# EAGLE schematic RCShield-v4 (EAGLE 6.3)
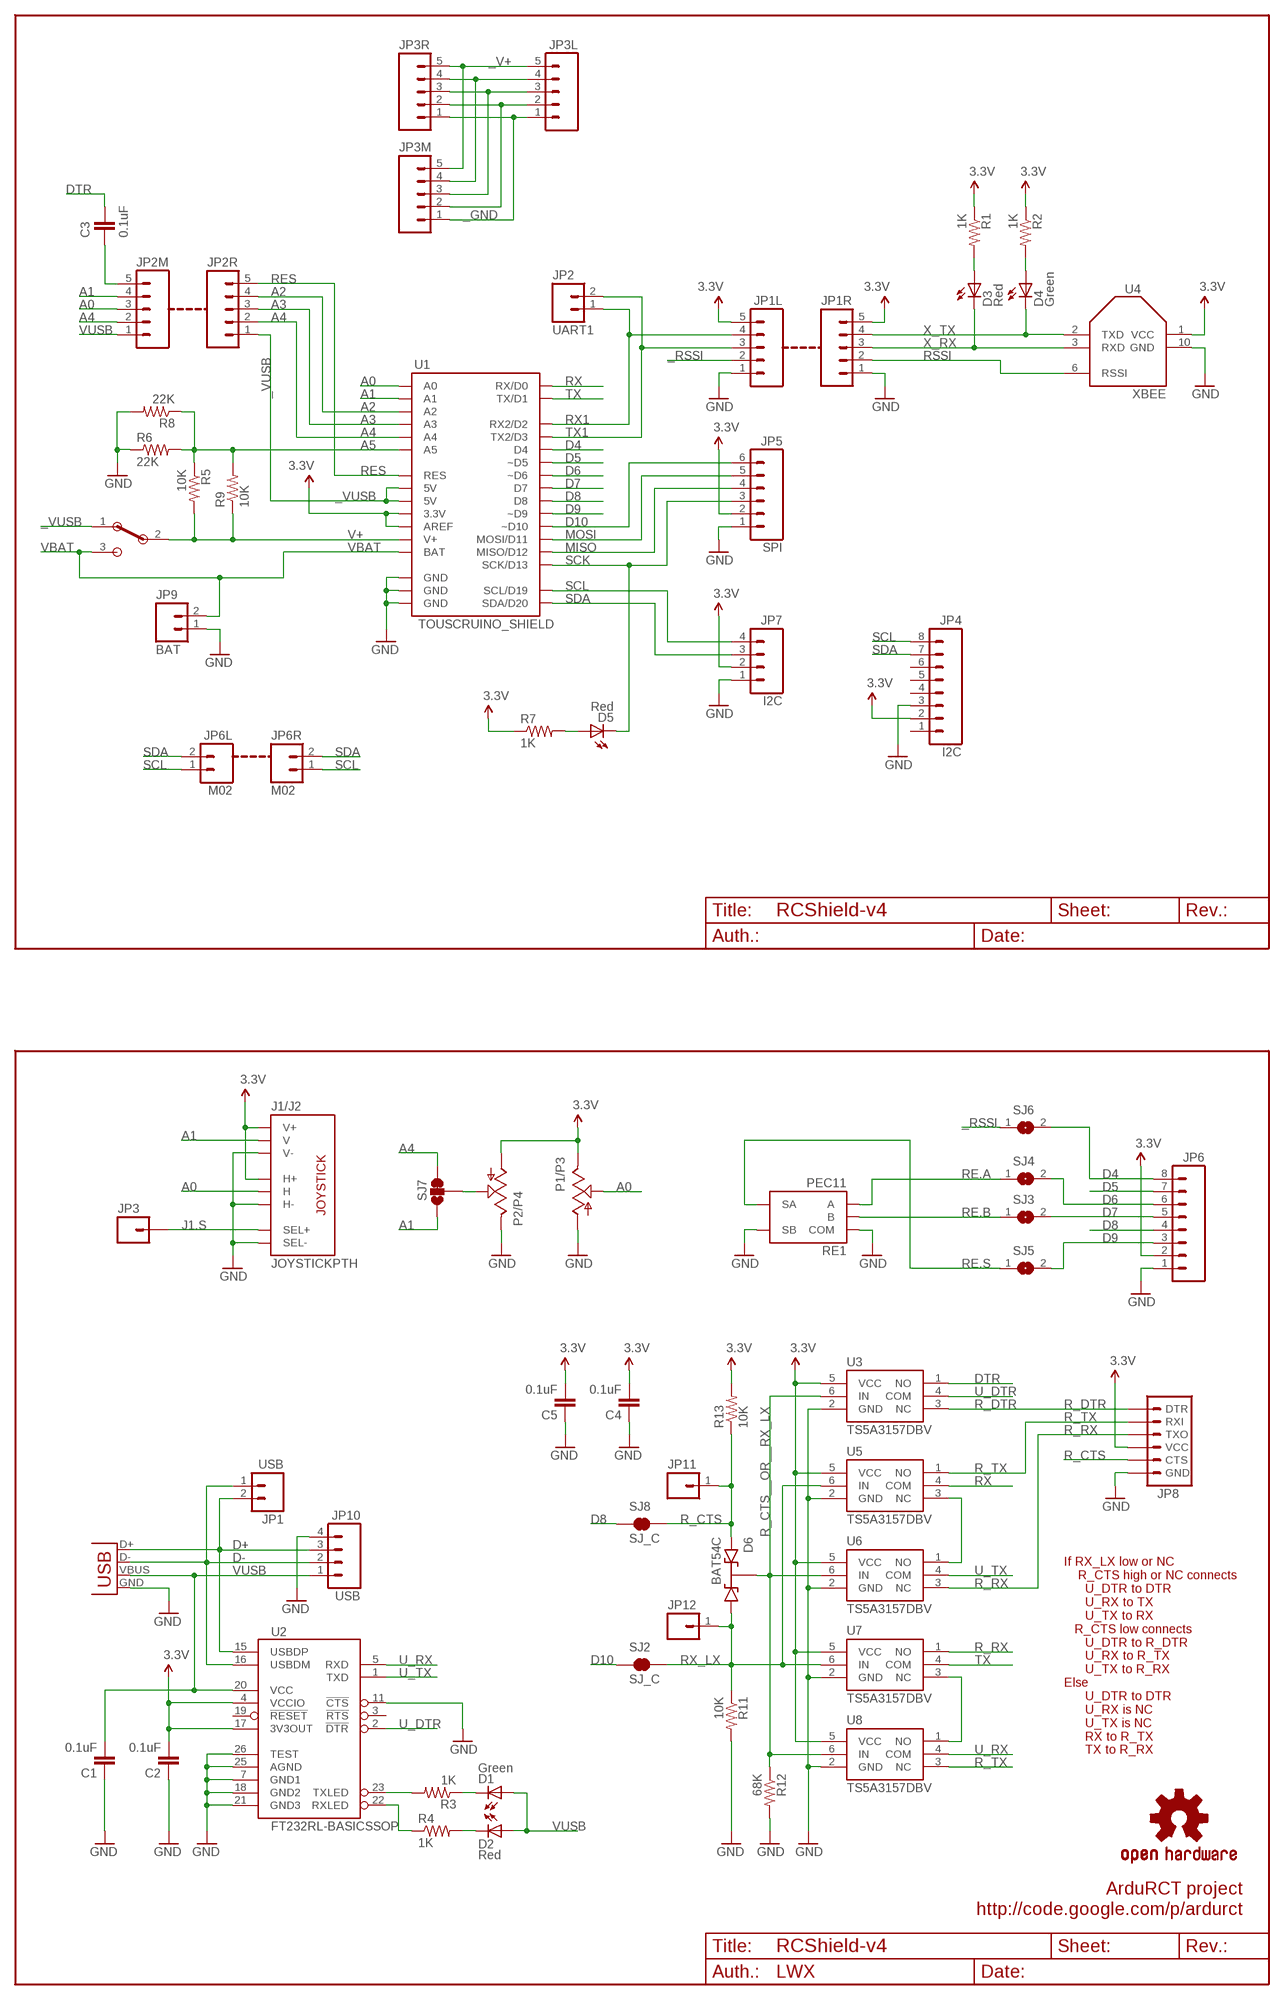
[diagram p0: schematic, sheet 1]

## Parts
C1  0.1uF  CAP0805  [0805]
C2  0.1uF  CAP0805  [0805]
C3  0.1uF  CAP0805  [0805]
C4  0.1uF  CAP0805  [0805]
C5  0.1uF  CAP0805  [0805]
D1  Green  LED  [LED]
D2  Red  LED  [LED]
D3  Red  LED  [LED]
D4  Green  LED  [LED]
D5  Red  LED  [LED]
D6  BAT54C  [SOT23-3]
J1/J2  JOYSTICKPTH  [JOYSTICK]
JP1  USB  M02  [1X02]
JP1L  M05  [2+3]
JP1R  M05  [2+3]
JP2  UART1  M02  [1X02]
JP2M  M05  [2+3]
JP2R  M05  [2+3]
JP3  M01PTH  [1X01]
JP3L  M05  [2+3]
JP3M  M05  [2+3]
JP3R  M05  [2+3]
JP4  I2C  M08  [1X08]
JP5  SPI  M06SIP  [1X06]
JP6  M08  [1X08]
JP6L  M02  [1X02]
JP6R  M02  [1X02]
JP7  I2C  M04  [1X04]
JP8  ARDUINO_SERIAL_PROGRAM  [1X06_F]
JP9  BAT  M02  [1X02]
JP10  USB  M04  [1X04]
JP11  M01SMALL  [1X01_S]
JP12  M01SMALL  [1X01_S]
P1/P3  POT  [ALPS_POT]
P2/P4  POT  [ALPS_POT]
R1  1K  RESISTOR0805-RES  [0805]
R2  1K  RESISTOR0805-RES  [0805]
R3  1K  RESISTOR0805-RES  [0805]
R4  1K  RESISTOR0805-RES  [0805]
R5  10K  RESISTOR0805-RES  [0805]
R6  22K  RESISTOR0805-RES  [0805]
R7  1K  RESISTOR0805-RES  [0805]
R8  22K  R-US_0207/7  [0207/7]
R9  10K  R-US_0207/7  [0207/7]
R11  10K  RESISTOR0805-RES  [0805]
R12  68K  RESISTOR0805-RES  [0805]
R13  10K  RESISTOR0805-RES  [0805]
RE1  PEC11  [PEC11]
S4  EG1224  [EG1224]
SJ2  SJ_C  [SJ_C]
SJ3  SJ  [SJ]
SJ4  SJ  [SJ]
SJ5  SJ  [SJ]
SJ6  SJ  [SJ]
SJ7  SJ_2WAYS_1-2W  [SJ_2WAYS_1-2]
SJ8  SJ_C  [SJ_C]
U1  TOUSCRUINO_SHIELD  TOUSCRUINO_SHIELDSPLIT  [TOUSCRUINO_SHIELD_SPLIT]
U2  FT232RL-BASICSSOP  [SSOP28DB]
U3  TS5A3157DBV  [SOT23-6]
U4  XBEE  XBEE-RSSI  [XBEE-SMD]
U5  TS5A3157DBV  [SOT23-6]
U6  TS5A3157DBV  [SOT23-6]
U7  TS5A3157DBV  [SOT23-6]
U8  TS5A3157DBV  [SOT23-6]
U$1  OSHW-LOGOM  [OSHW-LOGO-M]
X1  USB  [USB-MICROB]

## Nets
3.3V: C2.2 C4.2 C5.2 J1/J2.H1(H+) J1/J2.V1(V+) JP1L.5 JP1R.5 JP4.2 JP5.2 JP6.2 JP7.2 JP8.4(VCC) P1/P3.P$1(E) P2/P4.P$3(A) R1.1 R2.1 R7.1 R13.2 U1.3.3V U1.AREF U2.4(VCCIO) U2.17(3V3OUT) U3.5(VCC) U4.1(VCC) U5.5(VCC) U6.5(VCC) U7.5(VCC) U8.5(VCC)
_GND [vcc]: JP3L.1 JP3M.1 JP3R.1
_RSSI: JP1L.2 SJ6.1
_V+: JP3L.5 JP3M.5 JP3R.5
_VUSB: JP2R.1 S4.1 U1.5V@0(5V) U1.5V@1(5V)
A0: J1/J2.H2(H) JP2M.3 P1/P3.P$2(S) U1.A0
A1: J1/J2.V2(V) JP2M.4 SJ7.3 U1.A1
A2: JP2R.4 U1.A2
A3: JP2R.3 U1.A3
A4: JP2M.2 JP2R.2 SJ7.1 U1.A4
A5: R5.1 R6.2 R8.1 R9.2 U1.A5
D4: JP6.8 SJ6.2 U1.D4
D5: JP6.7 U1.D5(~D5)
D6: JP6.6 SJ4.2 U1.D6(~D6)
D7: JP6.5 SJ3.2 U1.D7
D8: JP6.4 SJ8.1 U1.D8
D9: JP6.3 SJ5.2 U1.D9(~D9)
D10: JP5.6 SJ2.1 U1.D10(~D10)
D+: JP1.2 JP10.3 U2.15(USBDP) X1.D+
D-: JP1.1 JP10.2 U2.16(USBDM) X1.D-
DTR: C3.1 U3.1(NO)
GND [vcc]: C1.1 C2.1 C4.1 C5.1 J1/J2.B2A(SEL-) J1/J2.H3(H-) J1/J2.V3(V-) JP1L.1 JP1R.1 JP4.3 JP5.1 JP6.1 JP7.1 JP8.6(GND) JP9.1 JP10.4 P1/P3.P$3(A) P2/P4.P$1(E) R6.1 R8.2 R11.2 R12.2 RE1.C(COM) RE1.S2(SB) U1.GND@0(GND) U1.GND@1(GND) U1.GND@2(GND) U2.7(GND1) U2.11(!CTS) U2.18(GND2) U2.21(GND3) U2.25(AGND) U2.26(TEST) U3.2(GND) U4.10(GND) U5.2(GND) U6.2(GND) U7.2(GND) U8.2(GND) X1.GND
J1.S: J1/J2.B1A(SEL+) JP3.1
MISO: JP5.4 U1.D12(MISO/D12)
MOSI: JP5.5 U1.D11(MOSI/D11)
N$1: C3.2 JP2M.5
N$4: JP3L.4 JP3M.4 JP3R.4
N$5: JP3L.3 JP3M.3 JP3R.3
N$6: JP3L.2 JP3M.2 JP3R.2
N$7: P2/P4.P$2(S) SJ7.2
N$8: D5.A1(A) R7.2
N$12: U7.3(NC) U8.1(NO)
N$13: U5.3(NC) U6.1(NO)
N$14: D3.A1(A) R1.2
N$18: R3.2 U2.23(TXLED)
N$22: R4.1 U2.22(RXLED)
N$25: D4.A1(A) R2.2
R_CTS: D6.2(A2) JP8.5(CTS) JP11.1 R13.1 SJ8.2
R_CTS__OR__RX_LX: D6.3(K) R12.1 U3.6(IN) U6.6(IN) U8.6(IN)
R_DTR: JP8.1(DTR) U3.3(NC)
R_RX: JP8.3(TXO) U6.3(NC) U7.1(NO)
R_TX: JP8.2(RXI) U5.1(NO) U8.3(NC)
RE.A: RE1.A SJ4.1
RE.B: RE1.B SJ3.1
RE.S: RE1.S1(SA) SJ5.1
RES: JP2R.5 U1.RES
RSSI: JP1R.2 U4.6(RSSI)
RX: U1.RX(RX/D0) U5.4(COM)
RX1: JP1L.4 JP2.1 U1.D2(RX2/D2)
RX_LX: D6.1(A1) JP12.1 R11.1 SJ2.2 U5.6(IN) U7.6(IN)
SCK: D5.C1(C) JP5.3 U1.D13(SCK/D13)
SCL: JP4.8 JP6L.1 JP6R.1 JP7.4 U1.SCL(SCL/D19)
SDA: JP4.7 JP6L.2 JP6R.2 JP7.3 U1.SDA(SDA/D20)
TX: U1.TX(TX/D1) U7.4(COM)
TX1: JP1L.3 JP2.2 U1.D3(TX2/D3)
U_DTR: U2.2(!DTR) U3.4(COM)
U_RX: U2.5(RXD) U8.4(COM)
U_RX_LED: D2.C1(C) R4.2
U_TX: U2.1(TXD) U6.4(COM)
U_TX_LED: D1.C1(C) R3.1
V+: R5.2 R9.1 S4.2 U1.V+
VBAT: JP9.2 S4.3 U1.BAT
VUSB: C1.2 D1.A1(A) D2.A1(A) JP2M.1 JP10.1 U2.20(VCC) X1.VBUS
X_RX: D3.C1(C) JP1R.3 U4.3(RXD)
X_TX: D4.C1(C) JP1R.4 U4.2(TXD)
Unconnected: JP4.1 JP4.4 JP4.5 JP4.6 U2.3(!RTS) U2.19(!RESET)

## Notes on the sheet
- If RX_LX low or NC
      R_CTS high or NC connects
        U_DTR to DTR
        U_RX to TX
        U_TX to RX
     R_CTS low connects
        U_DTR to R_DTR
        U_RX to R_TX
        U_TX to R_RX
  Else
        U_DTR to DTR
        U_RX is NC
        U_TX is NC
        RX to R_TX
        TX to R_RX
- ArduRCT project
- http://code.google.com/p/ardurct
- LWX

## Library data of the parts
C1-C5 = SparkFun:CAP: Capacitor Standard 0603 ceramic capacitor, and 0.1" leaded capacitor.
D1-D5 = wibauxl:LED
D6 = wibauxl:BAT54C
J1/J2 = SparkFun:JOYSTICK: Thumb Joystick Joystick commonly found in PS2 controllers. Two pots and a select switch. Footprint proven. Spark Fun Electronics SKU : COM-09032
JP1 JP2 JP6L JP6R JP9 = wibauxl:M02
JP1L JP1R JP2M JP2R JP3L JP3M JP3R = wibauxl:M05
JP3 = SparkFun:M01: Header 1 Standard 1-pin 0.1" header. Use with straight break away headers (SKU : PRT-00116), right angle break away headers (PRT-00553), swiss pins (PRT-00743), machine pins (PRT-00117), and female headers (PRT-00115).
JP4 JP6 = wibauxl:M08
JP5 = SparkFun:M06: Header 6 Standard 6-pin 0.1" header. Use with straight break away headers (SKU : PRT-00116), right angle break away headers (PRT-00553), swiss pins (PRT-00743), machine pins (PRT-00117), and female headers (PRT-00115). Molex polarized connector foot print use with SKU : PRT-08094 with associated crimp pins and housings. NOTES ON THE VARIANTS LOCK and LOCK_LONGPADS... This footprint was designed to help hold the alignment of a through-hole component (i.e. 6-pin header) while soldering it into place. You may notice that each hole has been shifted either up or down by 0.005 of an inch from it's more standard position (which is a perfectly straight line). This slight alteration caused the pins (the squares in the middle) to touch the edges of the holes. Because they are alternating, it causes a "brace" to hold the component in place. 0.005 has proven to be the perfect amount of "off-center" position when using our standard breakaway headers. Although looks a little odd when you look at the bare footprint, once you have a header in there, the alteration is very hard to notice. Also, if you push a header all the way into place, it is covered up entirely on the bottom side. This idea of altering the position of holes to aid alignment will be further integrated into the Sparkfun Library for other footprints. It can help hold any component with 3 or more connection pins.
JP7 JP10 = wibauxl:M04
JP8 = wibauxl:ARDUINO_SERIAL_PROGRAM
JP11 JP12 = wibauxl:M01
P1/P3 P2/P4 = wibauxl:POT
R1-R7 R11-R13 = SparkFun:RESISTOR: Resistor Basic schematic elements and footprints for 0603, 1206, and PTH resistors.
R8 R9 = resistor:R-US_: RESISTOR, American symbol
RE1 = wibauxl:PEC11
S4 = wibauxl:EG1224
SJ2 SJ8 = wibauxl:SJ_C
SJ3-SJ6 = jumper:SJ: SMD solder JUMPER
SJ7 = wibauxl:SJ_2WAYS_1-2
U1 = wibauxl:TOUSCRUINO_SHIELD
U2 = wibauxl:FT232RL-BASIC: USB UART This is the simplified version of the FT232RL unit. Only what you need, nothing you don't. Spark Fun Electronics SKU : COM-00650
U3 U5-U8 = wibauxl:TS5A3157DBV
U4 = wibauxl:XBEE-RSSI
U$1 = SparkFun:OSHW-LOGO: Open Source Hardware Logo This logo indicates the piece of hardware it is found on incorporates a OSHW license and/or adheres to the definition of open source hardware found here: http://freedomdefined.org/OSHW
X1 = wibauxl:USB

## Net classes
0 default: width 0.203 mm
1 vcc: width 0.254 mm